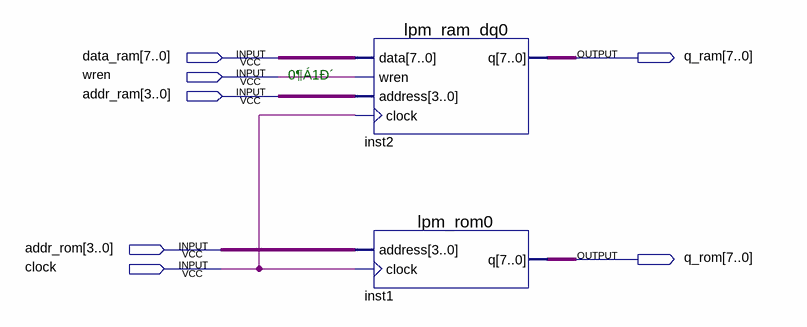
[diagram p0: schematic sheet]
// Quartus schematic men.bdf as structural Verilog: 2 symbols, 7 pins
module men (
  input  [7:0] data_ram,
  input  wren,
  input  [3:0] addr_ram,
  input  [3:0] addr_rom,
  input  clock,
  output [7:0] q_ram,
  output [7:0] q_rom
);

  lpm_ram_dq0 inst2 (.data(data_ram), .wren(wren), .address(addr_ram), .clock(clock), .q(q_ram));
  lpm_rom0 inst1 (.address(addr_rom), .clock(clock), .q(q_rom));

  // Notes on the sheet:
  //   0¶Á1Ð´
endmodule
